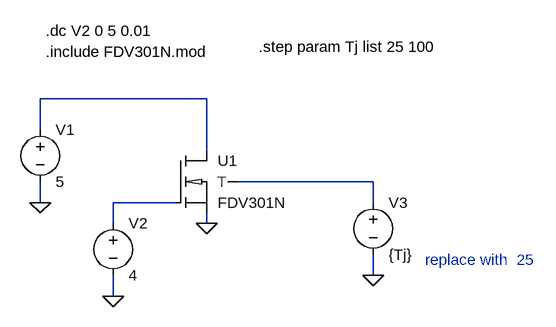
[diagram p0: schematic FDV301N_test.asc]
FDV301N_test.asc, the LTspice schematic file:
Version 4
SHEET 1 880 680
WIRE 80 224 80 144
WIRE 80 144 -176 144
WIRE -176 144 -176 192
WIRE -176 272 -176 304
WIRE 80 336 80 320
WIRE 32 304 -64 304
WIRE -64 304 -64 336
WIRE -64 416 -64 448
WIRE 336 272 336 304
WIRE 336 384 336 416
WIRE 128 272 336 272
FLAG -176 304 0
FLAG 80 336 0
FLAG -64 448 0
FLAG 336 416 0
SYMBOL D:\\Daten\\Ltc_spice_neu\\xnmos4_T 32 224 R0
SYMATTR InstName U1
SYMATTR SpiceModel FDV301N
SYMBOL voltage -176 176 R0
SYMATTR InstName V1
SYMATTR Value 5
SYMBOL voltage -64 320 R0
SYMATTR InstName V2
SYMATTR Value 4
SYMBOL voltage 336 288 R0
SYMATTR InstName V3
SYMATTR Value {Tj}
TEXT -168 72 Left 0 !.include FDV301N.mod
TEXT -168 40 Left 0 !.dc V2 0 5 0.01
TEXT 160 64 Left 0 !.step param Tj list 25 100
TEXT 416 392 Left 0 ;replace with  25

The netlist it stands for:
* FDV301N_test.asc
XU1 N001 N002 0 N003 FDV301N  ; pins D G S Tj
V1 N001 0 5
V2 N002 0 4
V3 N003 0 {Tj}
.include FDV301N.mod
.dc V2 0 5 0.01
.step param Tj list 25 100
* replace with  25
.backanno
.end